# EAGLE design XephConnect_v0.6 (EAGLE 9.3.2)
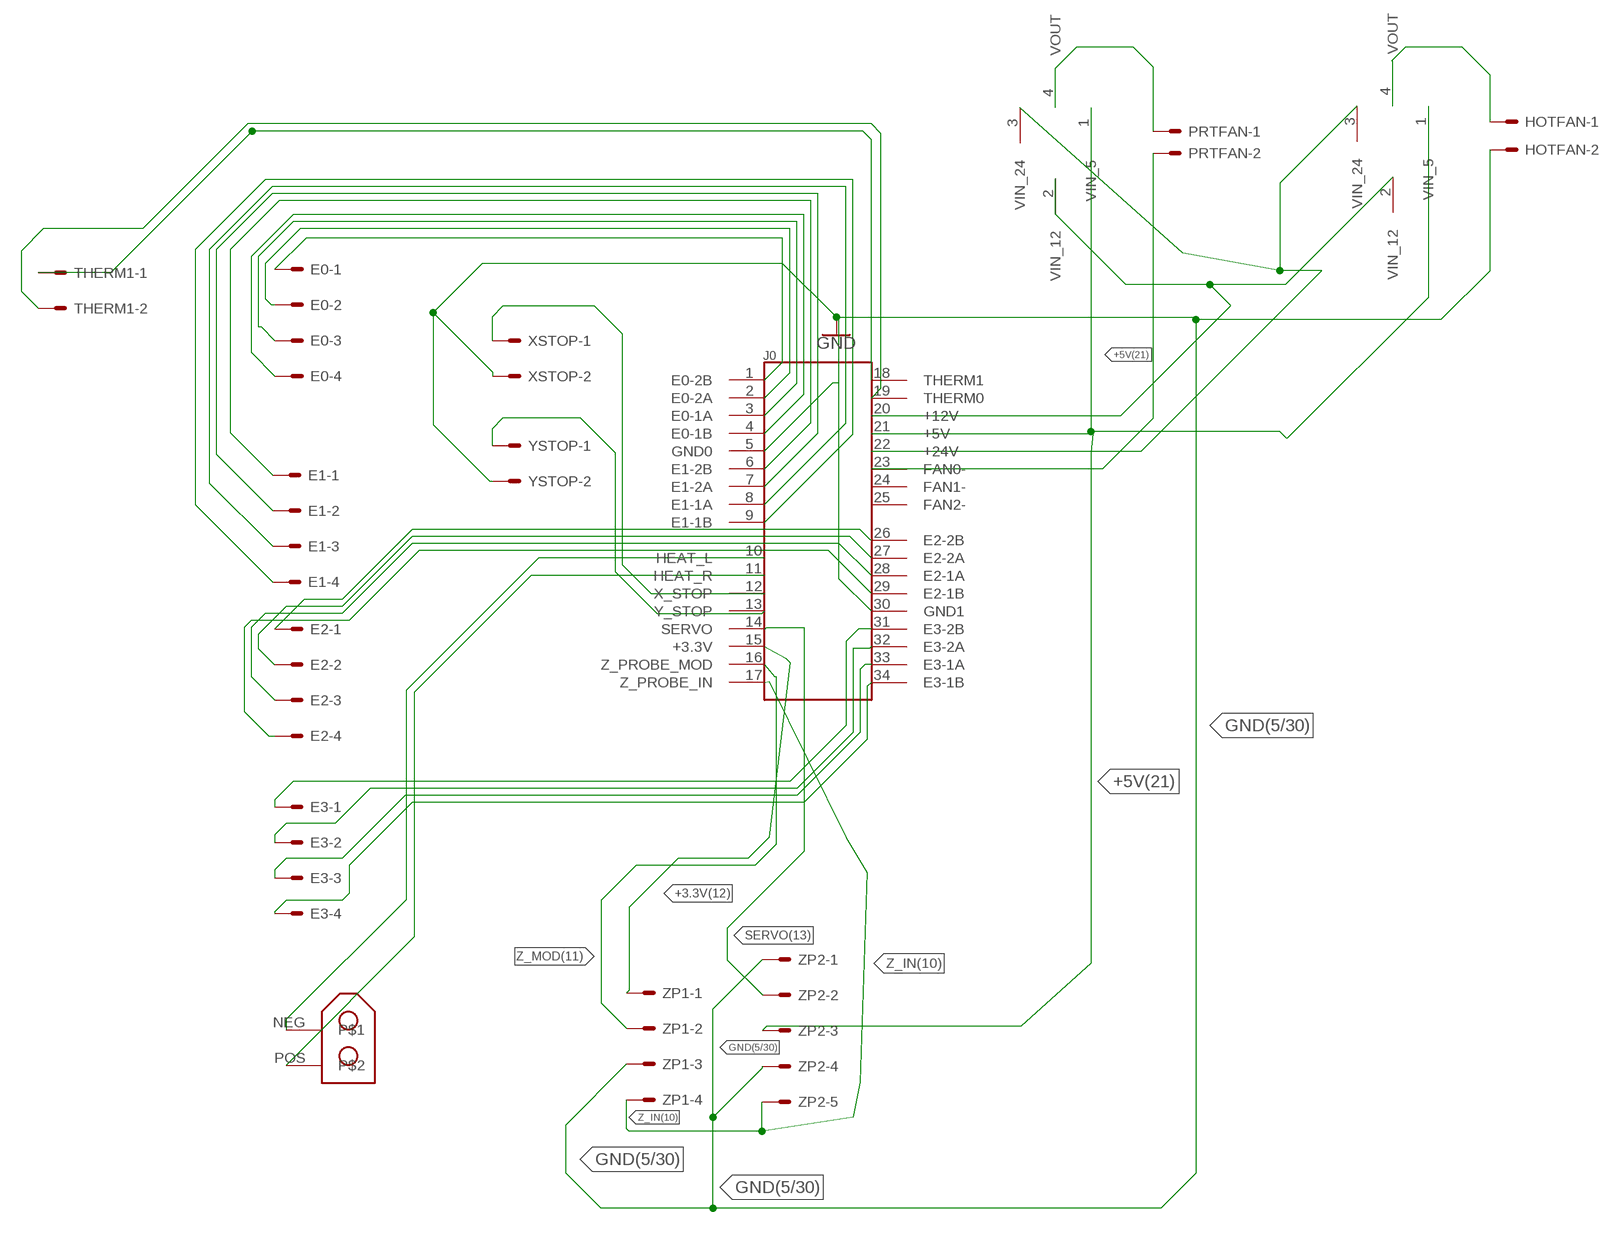
[diagram p0: schematic, sheet 1]

## Parts
E0  22-27-2041-04  [6410-04]
E1  22-27-2041-04  [6410-04]
E2  22-27-2041-04  [6410-04]
E3  22-27-2041-04  [6410-04]
HOTFAN  22-27-2021-02  [6410-02]
J0  6437288-1-V2  [TE_6437288-1]
PRTFAN  22-27-2021-02  [6410-02]
THERM1  22-27-2021-02  [6410-02]
U$1  CONN_03+01(T)(SM)  [1X03X01(SM)]
U$2  CONN_03+01(T)(SM)  [1X03X01(SM)]
U$3  XT30  [XT30-90]
XSTOP  22-27-2021-02  [6410-02]
YSTOP  22-27-2021-02  [6410-02]
ZP1  22-27-2041-04  [6410-04]
ZP2  22-27-2051-05  [6410-05]

## Nets
+3.3V(12) [3.3v]: J0.15(+3.3V) ZP1.1
+5V(21) [5v]: J0.21(+5V) U$1.1(VIN_5) U$2.1(VIN_5) ZP2.3
+12V(20) [12v]: J0.20(+12V) U$1.2(VIN_12) U$2.2(VIN_12)
+24V(22) [24v]: J0.22(+24V) U$1.3(VIN_24) U$2.3(VIN_24)
E0-1A [steppers]: E0.3 J0.3(E0-1A)
E0-1B [steppers]: E0.4 J0.4(E0-1B)
E0-2A [steppers]: E0.2 J0.2(E0-2A)
E0-2B [steppers]: E0.1 J0.1(E0-2B)
E1-1A [steppers]: E1.3 J0.8(E1-1A)
E1-1B [steppers]: E1.4 J0.9(E1-1B)
E1-2A [steppers]: E1.2 J0.7(E1-2A)
E1-2B [steppers]: E1.1 J0.6(E1-2B)
E2-1A [steppers]: E2.3 J0.28(E2-1A)
E2-1B [steppers]: E2.4 J0.29(E2-1B)
E2-2A [steppers]: E2.2 J0.27(E2-2A)
E2-2B [steppers]: E2.1 J0.26(E2-2B)
E3-1A [steppers]: E3.3 J0.33(E3-1A)
E3-1B [steppers]: E3.4 J0.34(E3-1B)
E3-2A [steppers]: E3.2 J0.32(E3-2A)
E3-2B [steppers]: E3.1 J0.31(E3-2B)
FAN0-(23) [5v]: J0.23(FAN0-) PRTFAN.2
GND(5/30) [ground]: HOTFAN.2 J0.5(GND0) J0.30(GND1) XSTOP.2 YSTOP.2 ZP1.3 ZP2.1 ZP2.4 ; supply symbol labelled GND
HEAT0 [heatercart]: J0.10(HEAT_L) U$3.NEG
HEAT1 [heatercart]: J0.11(HEAT_R) U$3.POS
N$21 [24v]: HOTFAN.1 U$2.4(VOUT)
N$25 [24v]: PRTFAN.1 U$1.4(VOUT)
SERVO(13) [5v]: J0.14(SERVO) ZP2.2
THERM0 [signal]: J0.18(THERM1) THERM1.1
THERM1 [signal]: J0.19(THERM0) THERM1.2
X_STOP: J0.12(X_STOP) XSTOP.1
Y_STOP: J0.13(Y_STOP) YSTOP.1
Z_IN(10): J0.17(Z_PROBE_IN) ZP1.4 ZP2.5
Z_MOD(11): J0.16(Z_PROBE_MOD) ZP1.2

## Power pins joined to a net without a drawn wire
FAN1-: J0.24(FAN1-)
FAN2-: J0.25(FAN2-)

## Library data of the parts
E0 E1-E3 ZP1 = con-molex_EDITED:22-?-04: CONNECTOR wire to board 2.54 mm (.1 inch) pitch header; MF: MOLEX; OC_FARNELL: unknown; OC_NEWARK: unknown
HOTFAN PRTFAN THERM1 XSTOP YSTOP = con-molex_EDITED:22-?-02: CONNECTOR wire to board 2.54 mm (.1 inch) pitch header; MF: MOLEX; OC_FARNELL: unknown; OC_NEWARK: unknown
J0 = 6437288-1:6437288-1-V2
U$1 U$2 = Xeph 3D Printing:CONN_03+01(T)(SM)
U$3 = openbuilds-eagle-library:XT30
ZP2 = con-molex_EDITED:22-?-05: CONNECTOR wire to board 2.54 mm (.1 inch) pitch header; MF: MOLEX; OC_FARNELL: unknown; OC_NEWARK: unknown

## Net classes
1 steppers: width 0.3 mm, drill 0.3 mm, clearance 0.15 mm
2 3.3v: width 0.2 mm, drill 0.2 mm, clearance 0.1 mm
3 5v: width 0.25 mm, drill 0.25 mm, clearance 0.1 mm
4 12v: width 0.3 mm, drill 0.3 mm, clearance 0.1 mm
5 24v: width 0.35 mm, drill 0.35 mm, clearance 0.1 mm
6 ground: width 0.6 mm, drill 0.6 mm, clearance 0.25 mm
7 heatercart: width 0.6 mm, drill 0.6 mm, clearance 0.15 mm
8 signal: width 0.2 mm, drill 0.2 mm, clearance 0.1 mm

## Board
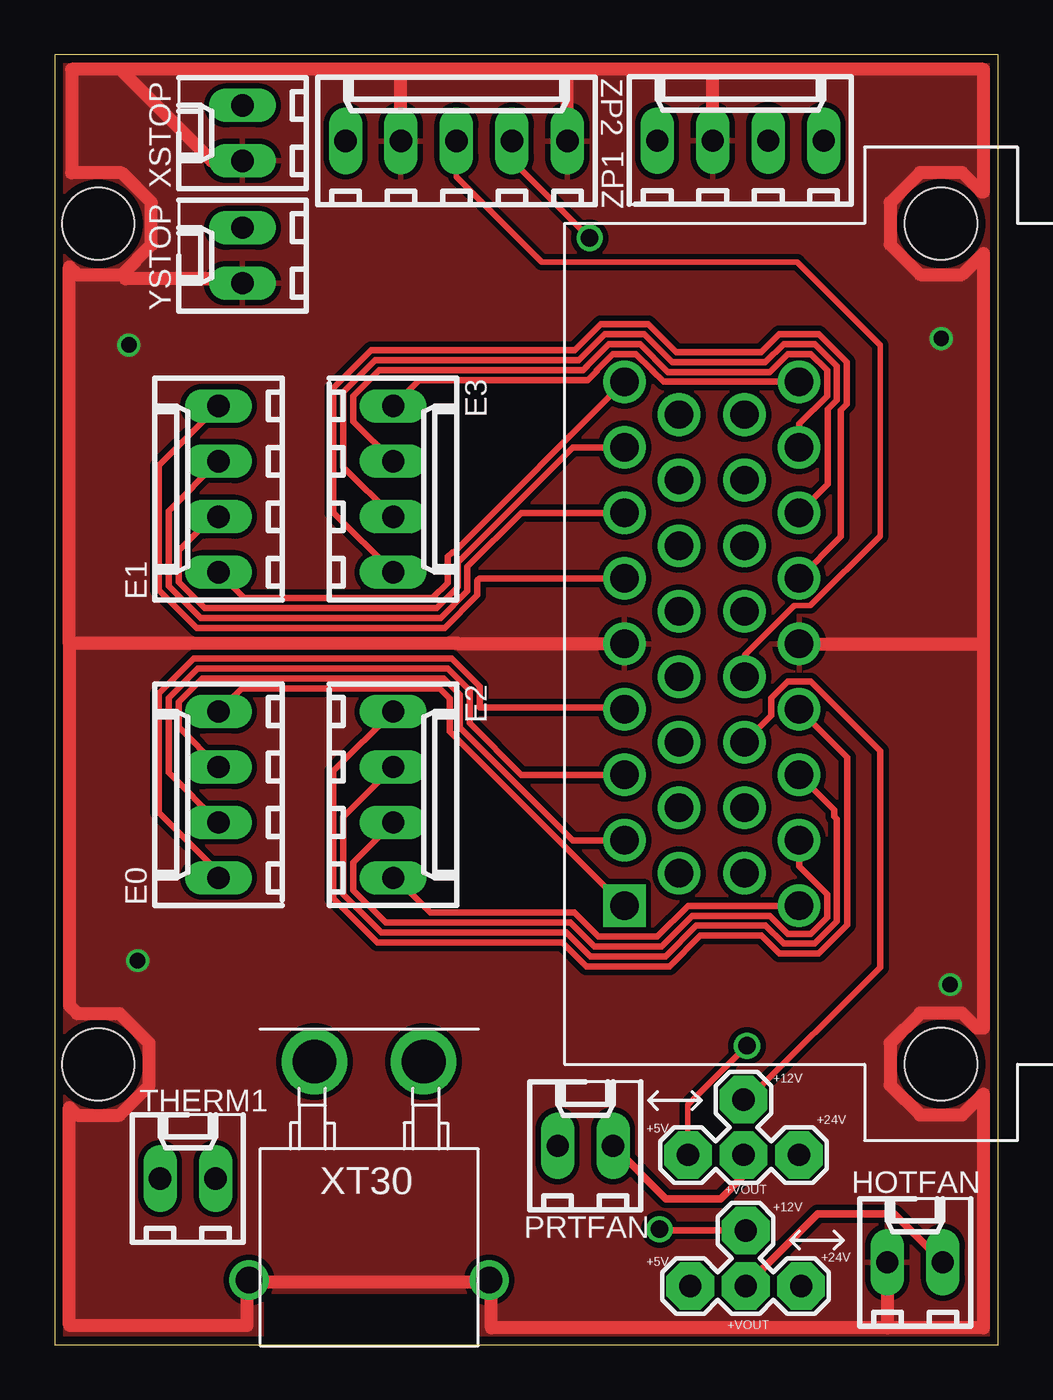
[diagram p1: board, top side]
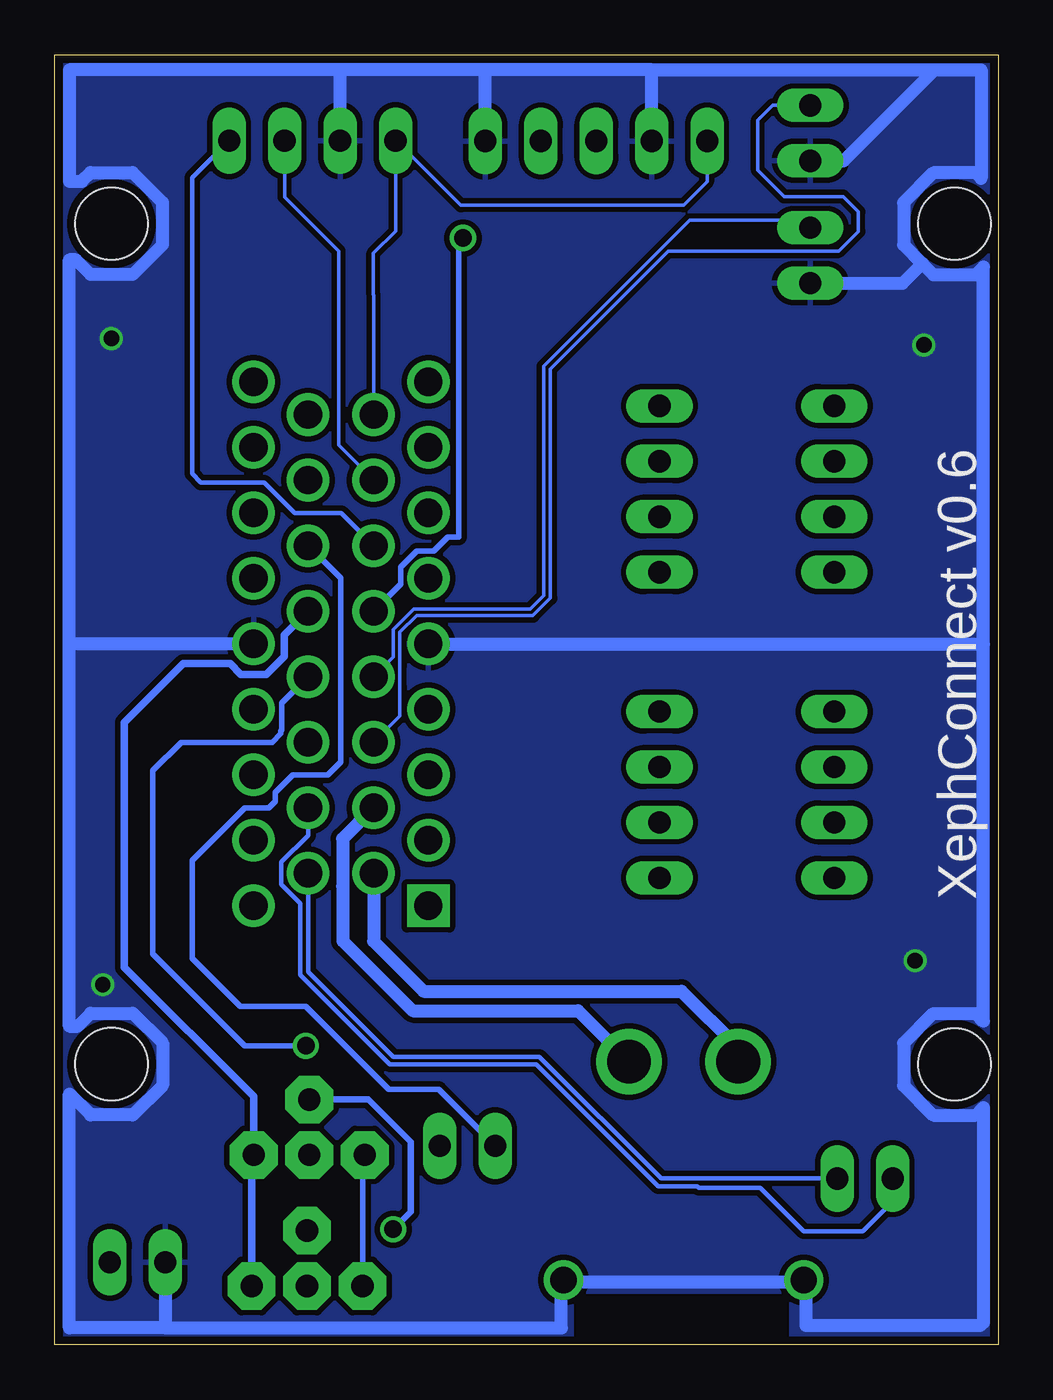
[diagram p2: board, bottom side, seen from below]

Size 43.2 x 59.1 mm. Coordinates in mm from the lower left corner, seen from the top.
Outline: 0,0 43.2,0 43.2,59.1 0,59.1 0,0
Copper layers (1*16): Top 0.035559375mm / dielectric 1.6mm / Bottom 0.035559375mm
Design rules "oshpark-2layer *": minimum track width 6mil, minimum drill 10mil, track to track 6mil, track to pad 6mil, pad to pad 6mil, via to via 6mil, smd to smd 6mil, copper to edge 15mil, drill to drill 6mil, minimum pad ring 5mil, minimum via ring 5mil, stop-mask expansion 2.5mil, vias tented up to drill 0.8mm, thermal gap 10mil
Holes 3.3 mm at 2,51.35 2,12.85

### Footprints (pad centres in the part's own frame; a part is rotated, then mirrored left to right if it is on the bottom)
6410-04 = drill 1.016 long: 1 3.81,0; 2 1.27,0; 3 -1.27,0; 4 -3.81,0
6410-02 = drill 1.016 long: 1 1.27,0; 2 -1.27,0
TE_6437288-1 = drill 1.3 square: 1 -12,4 | drill 1.3: 2 -9,4; 3 -6,4; 4 -3,4; 5 0,4; 6 3,4; 7 6,4; 8 9,4; 9 12,4; 10 -10.5,1.5; 11 -7.5,1.5; 12 -4.5,1.5; 13 -1.5,1.5; 14 1.5,1.5; 15 4.5,1.5; 16 7.5,1.5; 17 10.5,1.5; 18 -10.5,-1.5; 19 -7.5,-1.5; 20 -4.5,-1.5; 21 -1.5,-1.5; 22 1.5,-1.5; 23 4.5,-1.5; 24 7.5,-1.5; 25 10.5,-1.5; 26 -12,-4; 27 -9,-4; 28 -6,-4; 29 -3,-4; 30 0,-4; 31 3,-4; 32 6,-4; 33 9,-4; 34 12,-4 | hole 3.3: -19.25,-10.5; 19.25,-10.5
1X03X01(SM) = drill 1.016 pad 2.184 octagon: 1 0,0; 2 2.54,2.54; 3 5.08,0; 4 2.54,0
XT30-90 = drill 1.2: GND0 -5.5,-3; GND1 5.5,-3 | drill 2: NEG 2.5,-13; POS -2.5,-13
6410-05 = drill 1.016 long: 1 5.08,0; 2 2.54,0; 3 0,0; 4 -2.54,0; 5 -5.08,0

### Placement (x,y rotation side)
E0  7.5,25.2 90 top
E1  7.5,39.2 90 top
E2  15.5,25.2 270 top
E3  15.5,39.2 270 top
HOTFAN  39.4,3.78 0 top
J0  30.09,32.11 90 top
PRTFAN  24.3,9.12 0 top
THERM1  6.1,7.62 0 top
U$1  29,8.7 0 top
U$2  29.1,2.7 0 top
U$3  14.4,-0.03 180 top
XSTOP  8.6,55.5 90 top
YSTOP  8.6,49.9 90 top
ZP1  31.4,55.16 0 top
ZP2  18.4,55.14 0 top

### Tracks (layer width: path | path; a pad name or v marks a point on that pad's centre or on a via)
+3.3V(12)
  Bottom 0.2: J0.15 30.08,38.1 32.2,38.1 33.6,39.5 36.5,39.5 36.9,39.9 36.9,53.47 ZP1.1
+5V(21)  (via drill 0.8)
  Top 0.25: v31.7,13.7 29,11 U$1.1 | J0.21 31.59,31.59 33.86,33.86 34.61,33.86 37.8,37.05 37.8,45.8 34,49.6 22.3,49.6 18.4,53.5 ZP2.3
  Bottom 0.25: J0.21 32.8,29.4 32.8,28.17 32.84,28.13 32.84,28 33.24,27.6 37.4,27.6 38.7,26.3 38.7,17.9 34.5,13.7 v31.7,13.7 | U$1.1 29.1,8.6 U$2.1
+12V(20)  (via drill 0.8)
  Top 0.3: U$2.2 27.76,5.24 v27.7,5.3 | J0.20 32.81,28.83 32.81,29.64 33.56,30.39 34.62,30.39 35.37,29.64 35.37,29.63 37.8,27.2 37.8,17.3 31.74,11.24 U$1.2
  Bottom 0.3: U$1.2 28.84,11.24 26.9,9.3 26.9,6.1 v27.7,5.3
+24V(22)
  Bottom 0.35: U$2.3 34.18,8.6 U$1.3 34.08,11.38 40,17.3 40,28.5 37.3,31.2 35.16,31.2 34.67,30.71 33.51,30.71 32.69,31.53 32.69,32.51 J0.22
E0-1A
  Top 0.3: J0.3 21.37,26.11 19,28.47 19,29.97 18,30.98 6.56,30.98 5.22,29.64 5.22,26.21 E0.3
E0-1B
  Top 0.3: J0.4 26,29.2 19.46,29.2 19.46,30.16 18.19,31.43 6.38,31.43 4.77,29.83 4.77,24.39 7.5,21.66 E0.4
E0-2A
  Top 0.3: J0.2 23.73,23.11 18.55,28.29 18.55,29.79 17.81,30.53 6.75,30.53 5.67,29.45 5.67,28.3 E0.2
E0-2B
  Top 0.3: J0.1 18.1,28.1 18.1,29.6 17.63,30.07 8.56,30.07 E0.1
E1-1A
  Top 0.3: J0.8 23.73,41.11 18.45,35.83 18.45,34.71 17.49,33.75 6.88,33.75 5.67,34.95 5.67,36.37 7.23,37.93 E1.3
E1-1B
  Top 0.3: J0.9 18.28,36.3 18.2,36.3 18,36.1 18,34.9 17.3,34.2 8.69,34.2 E1.4
E1-2A
  Top 0.3: J0.7 21.37,38.11 18.91,35.64 18.91,34.53 17.67,33.3 6.69,33.3 5.22,34.76 5.22,38.19 E1.2
E1-2B
  Top 0.3: J0.6 19.47,35.11 19.36,35 19.36,34.34 17.86,32.84 6.5,32.84 4.77,34.57 4.77,40.28 E1.1
E2-1A
  Top 0.3: J0.28 35.7,24.5 35.7,24.2 35.82,24.08 35.82,19.39 34.81,18.38 33.37,18.38 32.55,19.2 29.39,19.2 27.97,17.79 24.53,17.79 23.42,18.89 14.97,18.89 13.22,20.64 13.22,24.19 E2.3
E2-1B
  Top 0.3: J0.29 36.3,26.9 36.3,19.23 34.99,17.93 33.19,17.93 32.36,18.75 29.57,18.75 28.16,17.34 24.34,17.34 23.24,18.44 14.78,18.44 12.77,20.45 12.77,26.28 E2.4
E2-2A
  Top 0.3: J0.27 34.1,21.91 35.37,20.64 35.37,19.58 34.62,18.83 33.56,18.83 32.74,19.66 29.2,19.66 27.79,18.25 24.71,18.25 23.61,19.35 15.15,19.35 13.67,20.83 13.67,22.1 E2.2
E2-2B
  Top 0.3: J0.26 29.01,20.11 27.6,18.7 24.9,18.7 23.8,19.8 17.2,19.8 15.61,21.39 E2.1
E3-1A
  Top 0.3: J0.33 34.09,42.19 35.37,43.47 35.37,44.64 34.62,45.39 33.56,45.39 32.74,44.56 28.08,44.56 26.81,45.84 25.37,45.84 24.36,44.83 24.36,44.8 24.21,44.65 14.88,44.65 13.67,43.45 13.67,42.3 E3.3
E3-1B
  Top 0.3: J0.34 27.89,44.11 27.37,44.63 27.37,44.64 26.62,45.39 25.56,45.39 24.81,44.64 24.81,44.61 24.4,44.2 16.69,44.2 E3.4
E3-2A
  Top 0.3: J0.32 35.4,39.42 35.4,42.86 35.82,43.28 35.82,44.83 34.81,45.84 33.37,45.84 32.55,45.02 28.27,45.02 26.99,46.29 25.19,46.29 24,45.11 14.69,45.11 13.22,43.64 13.22,40.21 E3.2
E3-2B
  Top 0.3: J0.31 36,37.02 36,42.82 36.27,43.09 36.27,45.01 34.99,46.29 33.19,46.29 32.36,45.47 28.46,45.47 27.18,46.75 25,46.75 23.81,45.56 14.5,45.56 12.77,43.83 12.77,38.12 E3.1
FAN0-(23)
  Bottom 0.25: J0.23 30.1,35.12 30.1,26.7 30.7,26.1 32.3,26.1 33.1,25.3 33.1,24.9 33.4,24.6 34.5,24.6 36.9,22.2 36.9,17.7 34.7,15.5 31.7,15.5 27.9,11.7 25.61,11.7 PRTFAN.2
GND(5/30)  (via drill 0.7)
  Top 0.6: 30.1,58.42 42.52,58.42 42.52,52.8 42.45,52.8 41.56,53.69 39.62,53.69 38.26,52.33 38.26,50.39 39.62,49.03 41.56,49.03 42.52,49.99 42.52,32.11 | 30.1,58.42 23.5,58.42 | 23.5,58.42 15.86,58.42 | 42.52,32.11 42.52,14.5 42.25,14.5 41.56,15.19 39.62,15.19 38.26,13.83 38.26,11.89 39.62,10.53 41.56,10.53 42.52,11.49 42.52,0.78 38.13,0.78 | 38.13,0.78 20,0.78 20,2.9 8.8,2.9 8.8,0.88 0.7,0.88 0.68,0.9 0.68,10.87 1.03,10.52 2.97,10.52 4.33,11.88 4.33,13.82 2.97,15.18 1.03,15.18 0.68,15.53 0.68,32.1 | 3.07,49.02 4.43,50.38 4.43,52.32 3.07,53.68 0.78,53.68 0.78,58.42 3,58.42 | HOTFAN.2 38.13,0.78 | ZP2.4 15.86,58.42 | J0.30 42.52,32.11 | YSTOP.2 8.4,48.83 3.26,48.83 3.07,49.02 | 3.07,49.02 1.03,49.02 0.68,49.37 0.68,32.1 | 15.86,58.42 3,58.42 | XSTOP.2 7.19,54.23 3,58.42 | J0.5 18.5,32.11 18.48,32.13 0.71,32.13 0.68,32.1 | ZP2.1 23.48,58.4 23.5,58.42 | ZP1.3 30.13,58.39 30.1,58.42
  Bottom 0.6: 15.86,58.4 23.5,58.4 | 23.5,58.4 30.1,58.4 | 30.1,58.4 42.52,58.4 42.52,53.3 41.95,53.3 41.56,53.69 39.62,53.69 38.26,52.33 38.26,50.39 39.62,49.03 41.56,49.03 42.23,49.7 42.52,49.7 42.52,32.1 | 38.13,0.78 42.52,0.78 42.52,11.49 41.56,10.53 39.62,10.53 38.26,11.89 38.26,13.83 39.62,15.19 41.56,15.19 42.15,14.6 42.52,14.6 42.52,32.1 | 38.13,0.78 20,0.78 20,2.9 8.7,2.9 8.8,2.8 8.8,0.88 0.82,0.88 0.68,1.02 0.68,10.87 1.03,10.52 2.97,10.52 4.33,11.88 4.33,13.82 2.97,15.18 1.03,15.18 0.68,14.83 0.68,32.1 | HOTFAN.2 38.13,0.78 | ZP2.4 15.86,58.4 | 3.47,49.53 4.33,50.38 4.33,52.32 2.97,53.68 1.03,53.68 0.78,53.43 0.78,58.4 2.9,58.4 | 3.47,49.53 2.97,49.02 1.03,49.02 0.68,49.37 0.68,32.1 | YSTOP.2 4.37,48.63 3.47,49.53 | 15.86,58.4 2.9,58.4 | XSTOP.2 7.07,54.23 2.9,58.4 | J0.5 0.69,32.11 0.68,32.1 | J0.30 42.51,32.11 42.52,32.1 | ZP2.1 23.48,58.38 23.5,58.4 | ZP1.3 30.13,58.37 30.1,58.4
  other vias: 3.4,45.8 3.8,17.6 40.6,46.1 41,16.5
  pour Bottom: 0.2,58.9 42.9,58.9 42.9,0.3 19.6,0.3 19.5,0.4 19.5,2.2 19.3,2.4 9.4,2.4 9.5,2.3 9.5,0.3 0.2,0.3
  pour Top: 0.2,58.9 42.9,58.9 42.9,0.3 19.5,0.3 19.5,2.1 19.2,2.4 9.2,2.4 9.5,2.1 9.5,0.3 0.2,0.3
HEAT0
  Bottom 0.6: J0.10 28.59,18.49 26.3,16.2 14.5,16.2 11.9,13.6 U$3.NEG
HEAT1
  Bottom 0.6: J0.11 30.02,23.18 30.02,21.02 30,21 30,18.5 26.8,15.3 19.23,15.3 U$3.POS
N$21
  Top 0.35: U$2.4 34.94,6 38.45,6 HOTFAN.1
N$25
  Top 0.35: U$1.4 31.54,7.74 30.5,6.7 27.99,6.7 PRTFAN.1
SERVO(13)  (via drill 0.8)
  Top 0.25: v24.5,50.7 20.94,54.26 ZP2.2
  Bottom 0.25: J0.14 27.34,34.86 27.34,35.63 26.61,36.36 25.84,36.36 25.2,37 24.7,37 24.7,50.5 v24.5,50.7
THERM0
  Bottom 0.2: J0.18 31.59,17.09 27.7,13.2 21,13.2 15.42,7.62 THERM1.1
THERM1
  Bottom 0.2: J0.19 31.59,23.35 32.82,22.12 32.82,21.1 31.94,20.23 31.94,16.94 27.85,12.85 21.15,12.85 15.57,7.27 13.77,7.27 13.7,7.2 10.9,7.2 8.9,5.2 6.2,5.2 4.83,6.57 THERM1.2
X_STOP
  Bottom 0.152: J0.12 27.4,28.8 27.4,30.1 27.39,30.11 27.39,31.11 27.39,32.65 26.63,33.41 25.55,33.41 25.54,33.4 21.3,33.4 20.5,34.2 20.5,44.7 15.1,50.1 7.3,50.1 6.4,51 6.4,51.9 7.1,52.6 9.8,52.6 11,53.8 11,56.1 10.33,56.77 XSTOP.1
Y_STOP
  Bottom 0.152: J0.13 27.7,31.5 27.7,32.78 26.75,33.72 25.42,33.72 25.41,33.7 21.43,33.7 20.81,34.33 20.81,44.83 14.13,51.5 8.94,51.5 YSTOP.1
Z_IN(10)
  Bottom 0.152: J0.17 28.59,48.09 28.6,48.1 28.6,50 27.59,51.01 27.59,54.9 | 27.59,54.9 ZP1.4 | ZP2.5 13.32,53.28 14.4,52.2 24.6,52.2 27.3,54.9 27.59,54.9
Z_MOD(11)
  Bottom 0.152: J0.16 30.2,41.22 30.2,50.1 32.67,52.57 ZP1.2

### Text on the board
tNames: +12V | +5V | +24V | +VOUT | +12V | +24V | +5V | +VOUT
bNames: XephConnect v0.6